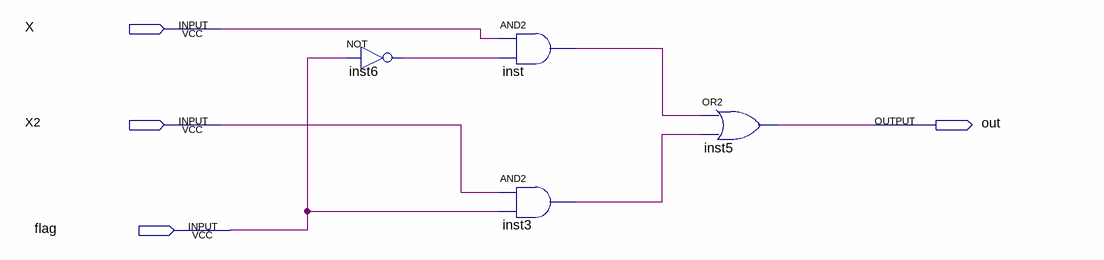
[diagram p0: schematic sheet]
// Quartus schematic seletorSinal.bdf as structural Verilog: 4 symbols, 4 pins
module seletorSinal (
  input  X,
  input  X2,
  input  flag,
  output out
);

  wire inst3_out, inst6_out, inst_out;

  not inst6 (inst6_out, flag);
  and inst (inst_out, X, inst6_out);
  and inst3 (inst3_out, X2, flag);
  or inst5 (out, inst_out, inst3_out);
endmodule
